# Altium schematic sheet CONNECTORS.SchDoc
size A
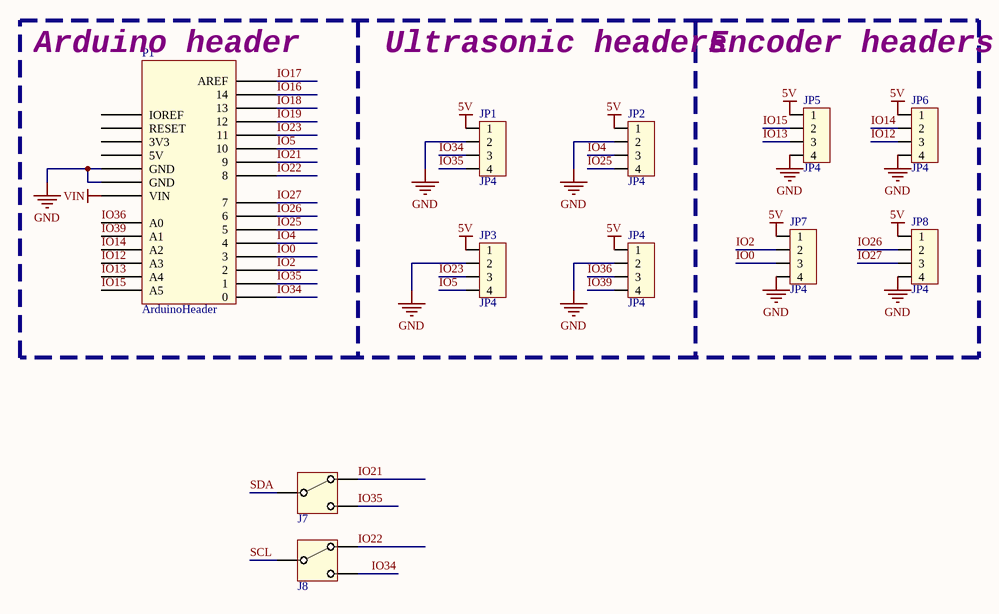
[diagram p0: CONNECTORS.SchDoc]

## Parts
J7  JUMPER-SOLDER-3WAY-BOTTOM  [JUMPER-SOLDER-3WAY-BOTTOM]  (value not drawn)
J8  JUMPER-SOLDER-3WAY-BOTTOM  [JUMPER-SOLDER-3WAY-BOTTOM]  (value not drawn)
JP1  JP4  [CON4]
JP2  JP4  [CON4]
JP3  JP4  [CON4]
JP4  JP4  [CON4]
JP5  JP4  [CON4]
JP6  JP4  [CON4]
JP7  JP4  [CON4]
JP8  JP4  [CON4]
P1  ArduinoHeader  [Arduino_header]

## Nets
5V: JP1.1 JP2.1 JP3.1 JP4.1 JP5.1 JP6.1 JP7.1 JP8.1
GND: JP1.2 JP2.2 JP3.2 JP4.2 JP5.4 JP6.4 JP7.4 JP8.4 P1.GND
VIN: P1.VIN
IO0: JP7.3 P1.3
IO2: JP7.2 P1.2
IO4: JP2.3 P1.4
IO5: JP3.4 P1.10
IO12: JP6.3 P1.A3
IO13: JP5.3 P1.A4
IO14: JP6.2 P1.A2
IO15: JP5.2 P1.A5
IO16: P1.14
IO17: P1.AREF
IO18: P1.13
IO19: P1.12
IO21: J7.0 P1.9
IO22: J8.0 P1.8
IO23: JP3.3 P1.11
IO25: JP2.4 P1.5
IO26: JP8.2 P1.6
IO27: JP8.3 P1.7
IO34: J8.2 JP1.3 P1.0
IO35: J7.2 JP1.4 P1.1
IO36: JP4.3 P1.A0
IO39: JP4.4 P1.A1
SCL: J8.1
SDA: J7.1

Not connected (* = marked no-connect by the designer): P1 3V3 5V IOREF RESET

## Notes on the sheet
- (near P1) Arduino header
- Ultrasonic headers
- Encoder headers

## Library data of the parts
JP1-JP8 = Con4: Connector 4; Value: Connector 4